# EAGLE schematic XILINX_XC6SLX9 (EAGLE 9.6.2)
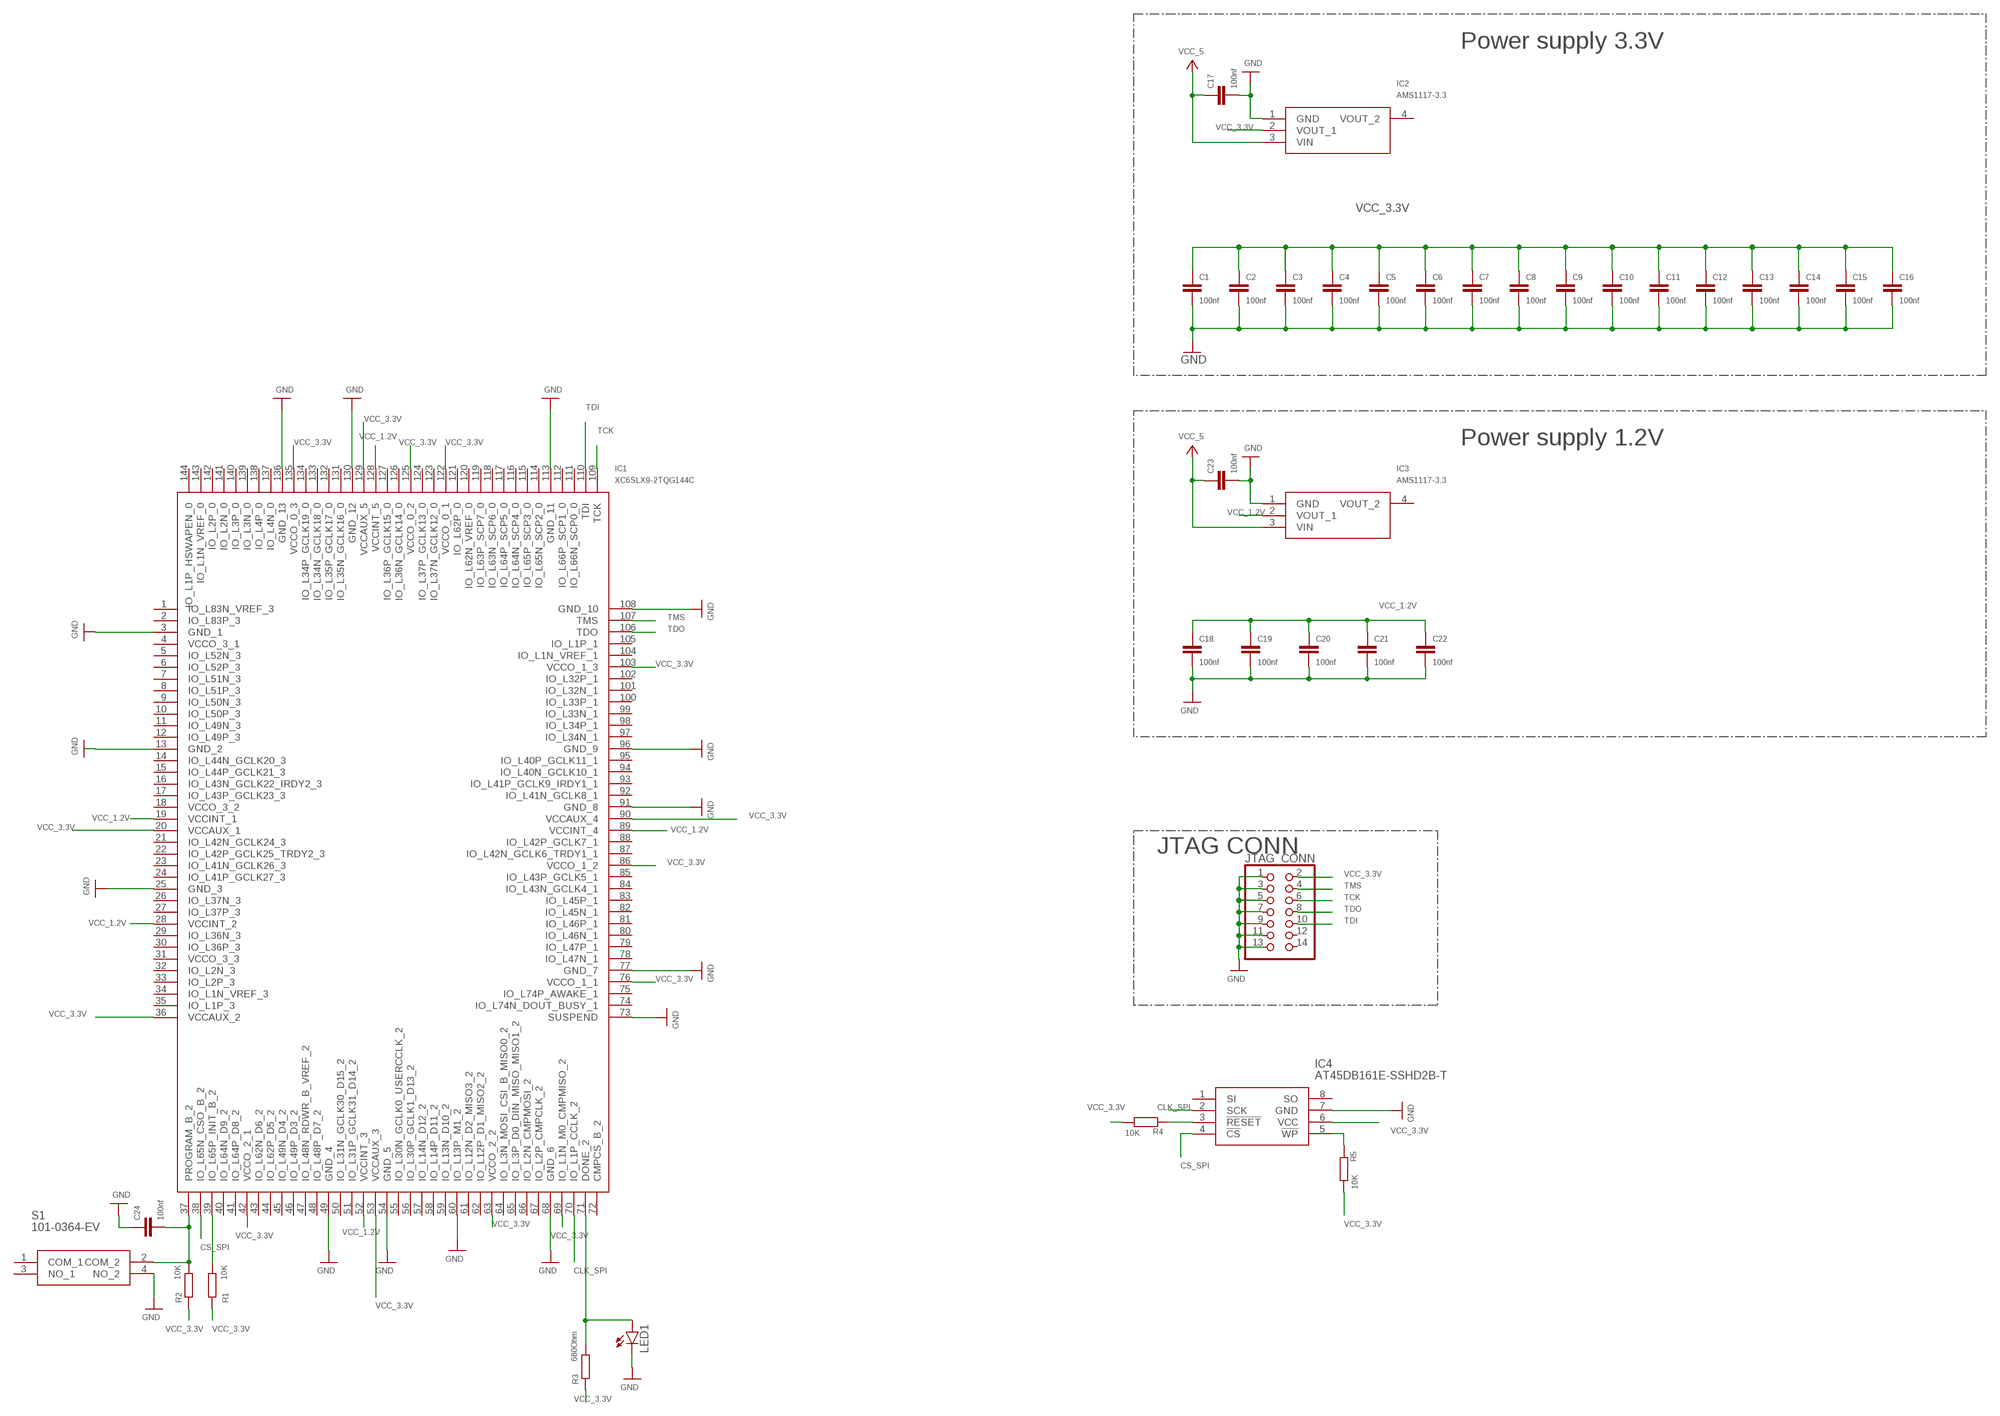
[diagram p0: schematic, sheet 1]

## Parts
C1  100nf  C-EUC0805  [C0805]
C2  100nf  C-EUC0805  [C0805]
C3  100nf  C-EUC0805  [C0805]
C4  100nf  C-EUC0805  [C0805]
C5  100nf  C-EUC0805  [C0805]
C6  100nf  C-EUC0805  [C0805]
C7  100nf  C-EUC0805  [C0805]
C8  100nf  C-EUC0805  [C0805]
C9  100nf  C-EUC0805  [C0805]
C10  100nf  C-EUC0805  [C0805]
C11  100nf  C-EUC0805  [C0805]
C12  100nf  C-EUC0805  [C0805]
C13  100nf  C-EUC0805  [C0805]
C14  100nf  C-EUC0805  [C0805]
C15  100nf  C-EUC0805  [C0805]
C16  100nf  C-EUC0805  [C0805]
C17  100nf  C-EUC0805  [C0805]
C18  100nf  C-EUC0805  [C0805]
C19  100nf  C-EUC0805  [C0805]
C20  100nf  C-EUC0805  [C0805]
C21  100nf  C-EUC0805  [C0805]
C22  100nf  C-EUC0805  [C0805]
C23  100nf  C-EUC0805  [C0805]
C24  100nf  C-EUC0805  [C0805]
IC1  XC6SLX9-2TQG144C  [QFP50P2200X2200X160-144N]
IC2  AMS1117-3.3  [SOT229P700X180-4N]
IC3  AMS1117-3.3  [SOT229P700X180-4N]
IC4  AT45DB161E-SSHD2B-T  [SOIC127P600X175-8N]
JTAG_CONN  PINHD-2X7  [2X07]
LED1  LEDCHIP-LED0805  [CHIP-LED0805]
R1  10K  R-EU_R0805  [R0805]
R2  10K  R-EU_R0805  [R0805]
R3  680Ohm  R-EU_R0805  [R0805]
R4  10K  R-EU_R0805  [R0805]
R5  10K  R-EU_R0805  [R0805]
S1  101-0364-EV  [1010364EV]

## Nets
CLK_SPI: IC1.70(IO_L1P_CCLK_2) IC4.2(SCK)
CS_SPI: IC1.38(IO_L65N_CSO_B_2) IC4.4(!CS)
GND: C1.2 C2.2 C3.2 C4.2 C5.2 C6.2 C7.2 C8.2 C9.2 C10.2 C11.2 C12.2 C13.2 C14.2 C15.2 C16.2 C17.2 C18.2 C19.2 C20.2 C21.2 C22.2 C23.2 C24.1 IC1.3(GND_1) IC1.13(GND_2) IC1.25(GND_3) IC1.49(GND_4) IC1.54(GND_5) IC1.60(IO_L13P_M1_2) IC1.68(GND_6) IC1.73(SUSPEND) IC1.77(GND_7) IC1.91(GND_8) IC1.96(GND_9) IC1.108(GND_10) IC1.113(GND_11) IC1.130(GND_12) IC1.136(GND_13) IC2.1(GND) IC3.1(GND) IC4.7(GND) JTAG_CONN.1 JTAG_CONN.3 JTAG_CONN.5 JTAG_CONN.7 JTAG_CONN.9 JTAG_CONN.11 JTAG_CONN.13 LED1.C S1.4(NO_2)
N$1: IC1.39(IO_L65P_INIT_B_2) R1.2
N$2: C24.2 IC1.37(PROGRAM_B_2) R2.2 S1.2(COM_2)
N$3: IC1.71(DONE_2) LED1.A R3.2
N$4: IC4.3(!RESET) R4.1
N$5: IC4.5(!WP) R5.1
TCK: IC1.109(TCK) JTAG_CONN.6
TDI: IC1.110(TDI) JTAG_CONN.10
TDO: IC1.106(TDO) JTAG_CONN.8
TMS: IC1.107(TMS) JTAG_CONN.4
VCC: C17.1 C23.1 IC2.3(VIN) IC3.3(VIN) ; supply symbol labelled VCC_5
VCC_1.2V: C18.1 C19.1 C20.1 C21.1 C22.1 IC1.19(VCCINT_1) IC1.28(VCCINT_2) IC1.52(VCCINT_3) IC1.89(VCCINT_4) IC1.128(VCCINT_5) IC3.2(VOUT_1)
VCC_3.3V: C1.1 C2.1 C3.1 C4.1 C5.1 C6.1 C7.1 C8.1 C9.1 C10.1 C11.1 C12.1 C13.1 C14.1 C15.1 C16.1 IC1.20(VCCAUX_1) IC1.36(VCCAUX_2) IC1.42(VCCO_2_1) IC1.53(VCCAUX_3) IC1.63(VCCO_2_2) IC1.69(IO_L1N_M0_CMPMISO_2) IC1.76(VCCO_1_1) IC1.86(VCCO_1_2) IC1.90(VCCAUX_4) IC1.103(VCCO_1_3) IC1.122(VCCO_0_1) IC1.125(VCCO_0_2) IC1.129(VCCAUX_5) IC1.135(VCCO_0_3) IC2.2(VOUT_1) IC4.6(VCC) JTAG_CONN.2 R1.1 R2.1 R3.1 R4.2 R5.2
Unconnected: IC1.1(IO_L83N_VREF_3) IC1.2(IO_L83P_3) IC1.4(VCCO_3_1) IC1.5(IO_L52N_3) IC1.6(IO_L52P_3) IC1.7(IO_L51N_3) IC1.8(IO_L51P_3) IC1.9(IO_L50N_3) IC1.10(IO_L50P_3) IC1.11(IO_L49N_3) IC1.12(IO_L49P_3) IC1.14(IO_L44N_GCLK20_3) IC1.15(IO_L44P_GCLK21_3) IC1.16(IO_L43N_GCLK22_IRDY2_3) IC1.17(IO_L43P_GCLK23_3) IC1.18(VCCO_3_2) IC1.21(IO_L42N_GCLK24_3) IC1.22(IO_L42P_GCLK25_TRDY2_3) IC1.23(IO_L41N_GCLK26_3) IC1.24(IO_L41P_GCLK27_3) IC1.26(IO_L37N_3) IC1.27(IO_L37P_3) IC1.29(IO_L36N_3) IC1.30(IO_L36P_3) IC1.31(VCCO_3_3) IC1.32(IO_L2N_3) IC1.33(IO_L2P_3) IC1.34(IO_L1N_VREF_3) IC1.35(IO_L1P_3) IC1.40(IO_L64N_D9_2) IC1.41(IO_L64P_D8_2) IC1.43(IO_L62N_D6_2) IC1.44(IO_L62P_D5_2) IC1.45(IO_L49N_D4_2) IC1.46(IO_L49P_D3_2) IC1.47(IO_L48N_RDWR_B_VREF_2) IC1.48(IO_L48P_D7_2) IC1.50(IO_L31N_GCLK30_D15_2) IC1.51(IO_L31P_GCLK31_D14_2) IC1.55(IO_L30N_GCLK0_USERCCLK_2) IC1.56(IO_L30P_GCLK1_D13_2) IC1.57(IO_L14N_D12_2) IC1.58(IO_L14P_D11_2) IC1.59(IO_L13N_D10_2) IC1.61(IO_L12N_D2_MISO3_2) IC1.62(IO_L12P_D1_MISO2_2) IC1.64(IO_L3N_MOSI_CSI_B_MISO0_2) IC1.65(IO_L3P_D0_DIN_MISO_MISO1_2) IC1.66(IO_L2N_CMPMOSI_2) IC1.67(IO_L2P_CMPCLK_2) IC1.72(CMPCS_B_2) IC1.74(IO_L74N_DOUT_BUSY_1) IC1.75(IO_L74P_AWAKE_1) IC1.78(IO_L47N_1) IC1.79(IO_L47P_1) IC1.80(IO_L46N_1) IC1.81(IO_L46P_1) IC1.82(IO_L45N_1) IC1.83(IO_L45P_1) IC1.84(IO_L43N_GCLK4_1) IC1.85(IO_L43P_GCLK5_1) IC1.87(IO_L42N_GCLK6_TRDY1_1) IC1.88(IO_L42P_GCLK7_1) IC1.92(IO_L41N_GCLK8_1) IC1.93(IO_L41P_GCLK9_IRDY1_1) IC1.94(IO_L40N_GCLK10_1) IC1.95(IO_L40P_GCLK11_1) IC1.97(IO_L34N_1) IC1.98(IO_L34P_1) IC1.99(IO_L33N_1) IC1.100(IO_L33P_1) IC1.101(IO_L32N_1) IC1.102(IO_L32P_1) IC1.104(IO_L1N_VREF_1) IC1.105(IO_L1P_1) IC1.111(IO_L66N_SCP0_0) IC1.112(IO_L66P_SCP1_0) IC1.114(IO_L65N_SCP2_0) IC1.115(IO_L65P_SCP3_0) IC1.116(IO_L64N_SCP4_0) IC1.117(IO_L64P_SCP5_0) IC1.118(IO_L63N_SCP6_0) IC1.119(IO_L63P_SCP7_0) IC1.120(IO_L62N_VREF_0) IC1.121(IO_L62P_0) IC1.123(IO_L37N_GCLK12_0) IC1.124(IO_L37P_GCLK13_0) IC1.126(IO_L36N_GCLK14_0) IC1.127(IO_L36P_GCLK15_0) IC1.131(IO_L35N_GCLK16_0) IC1.132(IO_L35P_GCLK17_0) IC1.133(IO_L34N_GCLK18_0) IC1.134(IO_L34P_GCLK19_0) IC1.137(IO_L4N_0) IC1.138(IO_L4P_0) IC1.139(IO_L3N_0) IC1.140(IO_L3P_0) IC1.141(IO_L2N_0) IC1.142(IO_L2P_0) IC1.143(IO_L1N_VREF_0) IC1.144(IO_L1P_HSWAPEN_0) IC2.4(VOUT_2) IC3.4(VOUT_2) IC4.1(SI) IC4.8(SO) JTAG_CONN.12 JTAG_CONN.14 S1.1(COM_1) S1.3(NO_1)

## Notes on the sheet
- Power supply 3.3V
- Power supply 1.2V
- JTAG CONN

## Library data of the parts
C1-C24 = rcl:C-EU: CAPACITOR, European symbol; SPICEPREFIX: C
IC1 = SamacSys_Parts:XC6SLX9-2TQG144C: FPGA Spartan-6 9152 logic cells TQFP144 XC6SLX9-2TQG144C, FPGA Spartan-6 9152 Cells, 576kbit, 5720 Blocks, 144-Pin TQFP Source: Datasheet <https://www.xilinx.com/support/documentation/data_sheets/ds160.pdf>; ARROW_PART_NUMBER: XC6SLX9-2TQG144C; DESCRIPTION: FPGA Spartan-6 9152 logic cells TQFP144 XC6SLX9-2TQG144C, FPGA Spartan-6 9152 Cells, 576kbit, 5720 Blocks, 144-Pin TQFP; HEIGHT: 1.6mm; MANUFACTURER_NAME: XILINX; MANUFACTURER_PART_NUMBER: XC6SLX9-2TQG144C; MOUSER_PART_NUMBER: 217-XC6SLX9-2TQG144C; MOUSER_PRICE-STOCK: https://www.mouser.co.uk/ProductDetail/Xilinx/XC6SLX9-2TQG144C?qs=rrS6PyfT74cKOj%2FX%2FYJ9TA%3D%3D
IC2 IC3 = SamacSys_Parts:AMS1117-3.3: 1A LOW DROPOUT VOLTAGE REGULATOR, SOT-223 Source: Datasheet <http://www.advanced-monolithic.com/pdf/ds1117.pdf>; ARROW_PART_NUMBER: AMS1117-3.3; DESCRIPTION: 1A LOW DROPOUT VOLTAGE REGULATOR, SOT-223; HEIGHT: 1.8mm; MANUFACTURER_NAME: Advanced Monolithic Systems; MANUFACTURER_PART_NUMBER: AMS1117-3.3
IC4 = SamacSys_Parts:AT45DB161E-SSHD2B-T: NOR Flash 16M 2.5-3.6V 85Mhz Data Flash Source: Datasheet <https://www.adestotech.com/wp-content/uploads/doc8782.pdf>; ARROW_PART_NUMBER: AT45DB161E-SSHD2B-T; DESCRIPTION: NOR Flash 16M 2.5-3.6V 85Mhz Data Flash; HEIGHT: 1.75mm; MANUFACTURER_NAME: Adesto Technologies; MANUFACTURER_PART_NUMBER: AT45DB161E-SSHD2B-T; MOUSER_PART_NUMBER: 556-A45DB161ESSHD2BT; MOUSER_PRICE-STOCK: https://www.mouser.co.uk/ProductDetail/Adesto-Technologies/AT45DB161E-SSHD2B-T?qs=tNs2o57S7OkLGAH4wCRh2Q%3D%3D
JTAG_CONN = pinhead:PINHD-2X7: PIN HEADER
LED1 = led:LED: LED OSRAM: - CHIPLED LG R971, LG N971, LY N971, LG Q971, LY Q971, LO R971, LY R971 LH N974, LH R974 LS Q976, LO Q976, LY Q976 LO Q996 - Hyper CHIPLED LW Q18S LB Q993, LB Q99A, LB R99A - SideLED LS A670, LO A670, LY A670, LG A670, LP A670 LB A673, LV A673, LT A673, LW A673 LH A674 LY A675 LS A676, LA A676, LO A676, LY A676, LW A676 LS A679, LY A679, LG A679 - Hyper Micro SIDELED® LS Y876, LA Y876, LO Y876, LY Y876 LT Y87S - SmartLED LW L88C, LW L88S LB L89C, LB L89S, LG L890 LS L89K, LO L89K, LY L89K LS L896, LA L896, LO L896, LY L896 - TOPLED LS T670, LO T670, LY T670, LG T670, LP T670 LSG T670, LSP T670, LSY T670, LOP T670, LYG T670 LG T671, LOG T671, LSG T671 LB T673, LV T673, LT T673, LW T673 LH T674 LS T676, LA T676, LO T676, LY T676, LB T676, LH T676, LSB T676, LW T676 LB T67C, LV T67C, LT T67C, LS T67K, LO T67K, LY T67K, LW E67C LS E67B, LA E67B, LO E67B, LY E67B, LB E67C, LV E67C, LT E67C LW T67C LS T679, LY T679, LG T679 LS T770, LO T770, LY T770, LG T770, LP T770 LB T773, LV T773, LT T773, LW T773 LH T774 LS E675, LA E675, LY E675, LS T675 LS T776, LA T776, LO T776, LY T776, LB T776 LHGB T686 LT T68C, LB T68C - Hyper Mini TOPLED® LB M676 - Mini TOPLED Santana® LG M470 LS M47K, LO M47K, LY M47K Source: http://www.osram.convergy.de LUXEON: - LUMILED® LXK2-PW12-R00, LXK2-PW12-S00, LXK2-PW14-U00, LXK2-PW14-V00 LXK2-PM12-R00, LXK2-PM12-S00, LXK2-PM14-U00 LXK2-PE12-Q00, LXK2-PE12-R00, LXK2-PE12-S00, LXK2-PE14-T00, LXK2-PE14-U00 LXK2-PB12-K00, LXK2-PB12-L00, LXK2-PB12-M00, LXK2-PB14-N00, LXK2-PB14-P00, LXK2-PB14-Q00 LXK2-PR12-L00, LXK2-PR12-M00, LXK2-PR14-Q00, LXK2-PR14-R00 LXK2-PD12-Q00, LXK2-PD12-R00, LXK2-PD12-S00 LXK2-PH12-R00, LXK2-PH12-S00 LXK2-PL12-P00, LXK2-PL12-Q00, LXK2-PL12-R00 Source: www.luxeon.com KINGBRIGHT: KA-3528ASYC Source: www.kingbright.com
R1-R5 = rcl:R-EU_: RESISTOR, European symbol; SPICEPREFIX: R
S1 = SamacSys_Parts:101-0364-EV: Tactile Switches TACTILE SWITCH 6X6MM Source: Datasheet <https://componentsearchengine.com/Datasheets/1/101-0364-EV.pdf>; ARROW_PART_NUMBER: 101-0364-EV; DESCRIPTION: Tactile Switches TACTILE SWITCH 6X6MM; HEIGHT: 2mm; MANUFACTURER_NAME: Mountain Switch; MANUFACTURER_PART_NUMBER: 101-0364-EV; MOUSER_PART_NUMBER: 101-0364-EV; MOUSER_PRICE-STOCK: https://www.mouser.co.uk/ProductDetail/Mountain-Switch/101-0364-EV?qs=Np9hobi9ysLawDJP688e5g%3D%3D